# Altium schematic sheet 02-FPGA.SchDoc
size A4
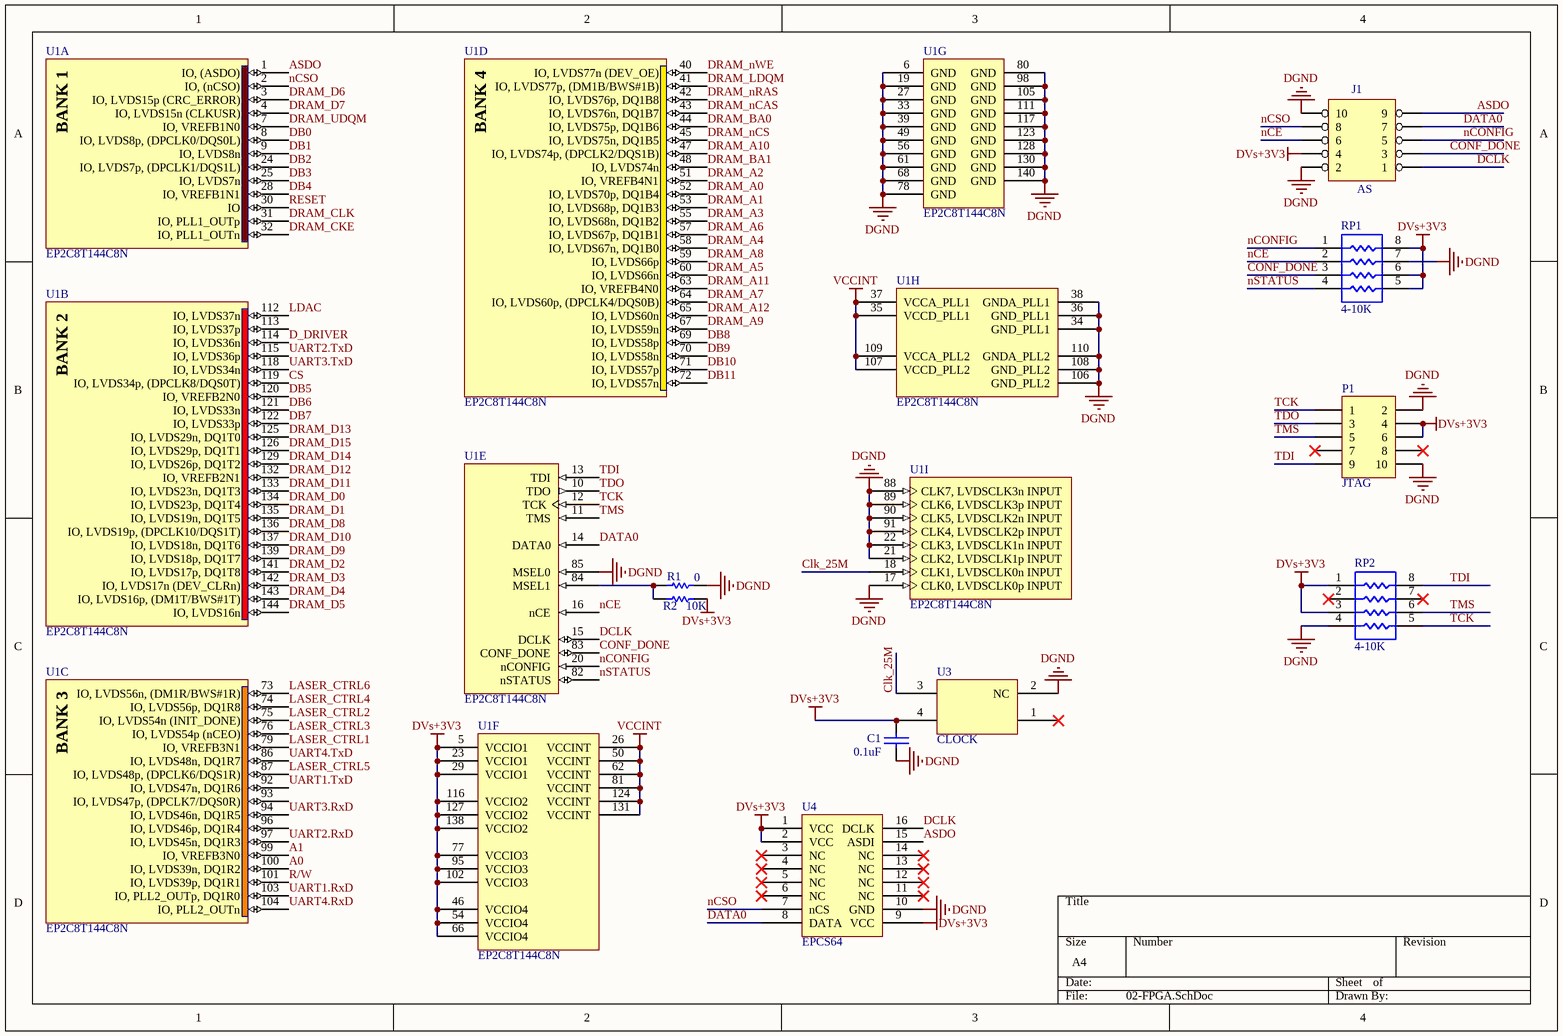
[diagram p0: 02-FPGA.SchDoc]

## Parts
C1  0.1uF  [0805-X]
J1  AS  [HDR2X5]
P1  JTAG  [HDR2X5]
R1  0  [0805-X]
R2  10K  [0805-X]
RP1  4-10K  [CRP4.1608]
RP2  4-10K  [CRP4.1608]
U1  EP2C8T144C8N  [F-QFP20X20-G144/N]  (parts A,B,C,D,E,F,G,H,I of 9)
U3  CLOCK  [SMX_20MH]
U4  EPCS64  [SO-G16/E6.9]

## Nets
DGND: C1.1 J1.2 J1.10 P1.2 P1.10 R1.2 RP1.7 RP2.4 U1.6(GND) U1.17(CLK0,_LVDSCLK0p_INPUT) U1.19(GND) U1.21(CLK2,_LVDSCLK1p_INPUT) U1.22(CLK3,_LVDSCLK1n_INPUT) U1.27(GND) U1.33(GND) U1.34(GND_PLL1) U1.36(GND_PLL1) U1.38(GNDA_PLL1) U1.39(GND) U1.49(GND) U1.56(GND) U1.61(GND) U1.68(GND) U1.78(GND) U1.80(GND) U1.85(MSEL0) U1.88(CLK7,_LVDSCLK3n_INPUT) U1.89(CLK6,_LVDSCLK3p_INPUT) U1.90(CLK5,_LVDSCLK2n_INPUT) U1.91(CLK4,_LVDSCLK2p_INPUT) U1.98(GND) U1.105(GND) U1.106(GND_PLL2) U1.108(GND_PLL2) U1.110(GNDA_PLL2) U1.111(GND) U1.117(GND) U1.123(GND) U1.128(GND) U1.130(GND) U1.140(GND) U3.2(NC) U4.10(GND)
DVs+3V3: C1.2 J1.4 P1.4 P1.6 R2.2 RP1.5 RP1.6 RP1.8 RP2.1 RP2.3 U1.5(VCCIO1) U1.23(VCCIO1) U1.29(VCCIO1) U1.46(VCCIO4) U1.54(VCCIO4) U1.66(VCCIO4) U1.77(VCCIO3) U1.95(VCCIO3) U1.102(VCCIO3) U1.116(VCCIO2) U1.127(VCCIO2) U1.138(VCCIO2) U3.4 U4.1(VCC) U4.2(VCC) U4.9(VCC)
VCCINT: U1.26(VCCINT) U1.35(VCCD_PLL1) U1.37(VCCA_PLL1) U1.50(VCCINT) U1.62(VCCINT) U1.81(VCCINT) U1.107(VCCD_PLL2) U1.109(VCCA_PLL2) U1.124(VCCINT) U1.131(VCCINT)
A0: U1.100(IO,_LVDS39n,_DQ1R2)
A1: U1.99(IO,_VREFB3N0)
ASDO: J1.9 U1.1(IO,_(ASDO)) U4.15(ASDI)
Clk_25M: U1.18(CLK1,_LVDSCLK0n_INPUT) U3.3
CONF_DONE: J1.3 RP1.3 U1.83(CONF_DONE)
CS: U1.119(IO,_LVDS34p,_(DPCLK8/DQS0T))
D_DRIVER: U1.114(IO,_LVDS36n)
DATA0: J1.7 U1.14(DATA0) U4.8(DATA)
DB0: U1.8(IO,_LVDS8p,_(DPCLK0/DQS0L))
DB1: U1.9(IO,_LVDS8n)
DB2: U1.24(IO,_LVDS7p,_(DPCLK1/DQS1L))
DB3: U1.25(IO,_LVDS7n)
DB4: U1.28(IO,_VREFB1N1)
DB5: U1.120(IO,_VREFB2N0)
DB6: U1.121(IO,_LVDS33n)
DB7: U1.122(IO,_LVDS33p)
DB8: U1.69(IO,_LVDS58p)
DB9: U1.70(IO,_LVDS58n)
DB10: U1.71(IO,_LVDS57p)
DB11: U1.72(IO,_LVDS57n)
DCLK: J1.1 U1.15(DCLK) U4.16(DCLK)
DRAM_A0: U1.52(IO,_LVDS70p,_DQ1B4)
DRAM_A1: U1.53(IO,_LVDS68p,_DQ1B3)
DRAM_A2: U1.51(IO,_VREFB4N1)
DRAM_A3: U1.55(IO,_LVDS68n,_DQ1B2)
DRAM_A4: U1.58(IO,_LVDS67n,_DQ1B0)
DRAM_A5: U1.60(IO,_LVDS66n)
DRAM_A6: U1.57(IO,_LVDS67p,_DQ1B1)
DRAM_A7: U1.64(IO,_LVDS60p,_(DPCLK4/DQS0B))
DRAM_A8: U1.59(IO,_LVDS66p)
DRAM_A9: U1.67(IO,_LVDS59n)
DRAM_A10: U1.47(IO,_LVDS74p,_(DPCLK2/DQS1B))
DRAM_A11: U1.63(IO,_VREFB4N0)
DRAM_A12: U1.65(IO,_LVDS60n)
DRAM_BA0: U1.44(IO,_LVDS75p,_DQ1B6)
DRAM_BA1: U1.48(IO,_LVDS74n)
DRAM_CKE: U1.32(IO,_PLL1_OUTn)
DRAM_CLK: U1.31(IO,_PLL1_OUTp)
DRAM_D0: U1.134(IO,_LVDS23p,_DQ1T4)
DRAM_D1: U1.135(IO,_LVDS19n,_DQ1T5)
DRAM_D2: U1.141(IO,_LVDS17p,_DQ1T8)
DRAM_D3: U1.142(IO,_LVDS17n_(DEV_CLRn))
DRAM_D4: U1.143(IO,_LVDS16p,_(DM1T/BWS#1T))
DRAM_D5: U1.144(IO,_LVDS16n)
DRAM_D6: U1.3(IO,_LVDS15p_(CRC_ERROR))
DRAM_D7: U1.4(IO,_LVDS15n_(CLKUSR))
DRAM_D8: U1.136(IO,_LVDS19p,_(DPCLK10/DQS1T))
DRAM_D9: U1.139(IO,_LVDS18p,_DQ1T7)
DRAM_D10: U1.137(IO,_LVDS18n,_DQ1T6)
DRAM_D11: U1.133(IO,_LVDS23n,_DQ1T3)
DRAM_D12: U1.132(IO,_VREFB2N1)
DRAM_D13: U1.125(IO,_LVDS29n,_DQ1T0)
DRAM_D14: U1.129(IO,_LVDS26p,_DQ1T2)
DRAM_D15: U1.126(IO,_LVDS29p,_DQ1T1)
DRAM_LDQM: U1.41(IO,_LVDS77p,_(DM1B/BWS#1B))
DRAM_nCAS: U1.43(IO,_LVDS76n,_DQ1B7)
DRAM_nCS: U1.45(IO,_LVDS75n,_DQ1B5)
DRAM_nRAS: U1.42(IO,_LVDS76p,_DQ1B8)
DRAM_nWE: U1.40(IO,_LVDS77n_(DEV_OE))
DRAM_UDQM: U1.7(IO,_VREFB1N0)
LASER_CTRL1: U1.79(IO,_VREFB3N1)
LASER_CTRL2: U1.75(IO,_LVDS54n_(INIT_DONE))
LASER_CTRL3: U1.76(IO,_LVDS54p_(nCEO))
LASER_CTRL4: U1.74(IO,_LVDS56p,_DQ1R8)
LASER_CTRL5: U1.87(IO,_LVDS48p,_(DPCLK6/DQS1R))
LASER_CTRL6: U1.73(IO,_LVDS56n,_(DM1R/BWS#1R))
LDAC: U1.112(IO,_LVDS37n)
nCE: J1.6 RP1.2 U1.16(nCE)
nCONFIG: J1.5 RP1.1 U1.20(nCONFIG)
nCSO: J1.8 U1.2(IO,_(nCSO)) U4.7(nCS)
nSTATUS: RP1.4 U1.82(nSTATUS)
R/W: U1.101(IO,_LVDS39p,_DQ1R1)
RESET: U1.30(IO)
TCK: P1.1 RP2.5 U1.12(TCK)
TDI: P1.9 RP2.8 U1.13(TDI)
TDO: P1.3 U1.10(TDO)
TMS: P1.5 RP2.6 U1.11(TMS)
UART1.RxD: U1.103(IO,_PLL2_OUTp,_DQ1R0)
UART1.TxD: U1.92(IO,_LVDS47n,_DQ1R6)
UART2.RxD: U1.97(IO,_LVDS45n,_DQ1R3)
UART2.TxD: U1.115(IO,_LVDS36p)
UART3.RxD: U1.94(IO,_LVDS46n,_DQ1R5)
UART3.TxD: U1.118(IO,_LVDS34n)
UART4.RxD: U1.104(IO,_PLL2_OUTn)
UART4.TxD: U1.86(IO,_LVDS48n,_DQ1R7)
NetR1_1: R1.1 R2.1 U1.84(MSEL1)

Not connected (* = marked no-connect by the designer): P1 7* 8*; RP2 2* 7*; U1 93(IO,_LVDS47p,_(DPCLK7/DQS0R)) 96(IO,_LVDS46p,_DQ1R4) 113(IO,_LVDS37p); U3 1*; U4 3(NC)* 4(NC)* 5(NC)* 6(NC)* 11(NC)* 12(NC)* 13(NC)* 14(NC)*

## Notes on the sheet
- (in symbol EP2C8T144C8N, part A) BANK 1
- (in symbol EP2C8T144C8N, part B) BANK 2
- (in symbol EP2C8T144C8N, part C) BANK 3
- (in symbol EP2C8T144C8N, part D) BANK 4

## Library data of the parts
C1 = CAP: Capacitor
J1 = HEADER 5X2
P1 = Header 5X2: Header, 5-Pin, Dual row; LatestRevisionDate: 17-Jul-2002; LatestRevisionNote: Re-released for DXP Platform.; Publisher: Altium Limited
R1 R2 = Res Semi: Semiconductor Resistor; Published: 8-Jun-2000; LatestRevisionDate: 17-Jul-2002; LatestRevisionNote: Re-released for DXP Platform.; PackageReference: AXIAL-0.5; Publisher: Altium Limited
  R1: Value: 0
  R2: Value: 10K
RP1 RP2 = RES-4
U1 = EP2C8T144C8N: Cyclone II Family, 1.2V FPGA, 85 I/O Pins, 2 PLLs, 144-Pin TQFP, Speed Grade 8, Commercial Grade, Pb-Free; Published: 4-Mar-2005; LatestRevisionDate: 14-May-2007; LatestRevisionNote: DATA0 pin is now INPUT.; DatasheetVersion: ver3.2, Apr-2007; PackageVersion: ver14.6, Feb-2007; PackageReference: TQFP144; Publisher: Altium Limited; PackageDescription: 144-Pin Plastic Thin Quad Flat Pack (TQFP144) - Wire Bond; Code_JEDEC: MS-026-BFB; ComponentLink1Description: Manufacturer Link; ComponentLink1URL: http://www.altera.com/products/devices/cyclone2/cy2-index.jsp; ComponentLink2Description: Handbook; ComponentLink2URL: http://www.altera.com/literature/hb/cyc2/cyc2_cii5v1.pdf; ComponentLink3Description: Packaging Specification; ComponentLink3URL: http://www.altera.com/literature/ds/dspkg.pdf
U4 = EPCS64: EPCS16 64 128
U3 = CLOCK: Text Field1: CLOCK; CLOCK: *